# Altium project Modulator.PrjPCB (part 3 of 4)

## Sheet Multiplier_channel.SchDoc: Modulator v1.0
size 420 x 297 mm; Author: shanasz; CompanyName: WUT; DrawnBy: shanasz; Organization: WUT ISE; Address1: Warsaw Univeristy of Technology; Address2: Nowowiejska 15/19; DocumentNumber: 4; Revision: -; SheetNumber: 4; SheetTotal: 6; EDA_Number: ARTIQ; Projet: ARTIQ/SINARA; ModifiedBy: -; CreateDate: XX/XX/XXXX; CheckedDate: -; Title2: Modulator channel; DivGrp: ISE; Designer: shanasz; ModifiedDate: -; ProjectName: ARTIQ/SINARA
Used 2 times, as channels M1, M2. Parts and nets are listed once, with the designators drawn on the sheet.
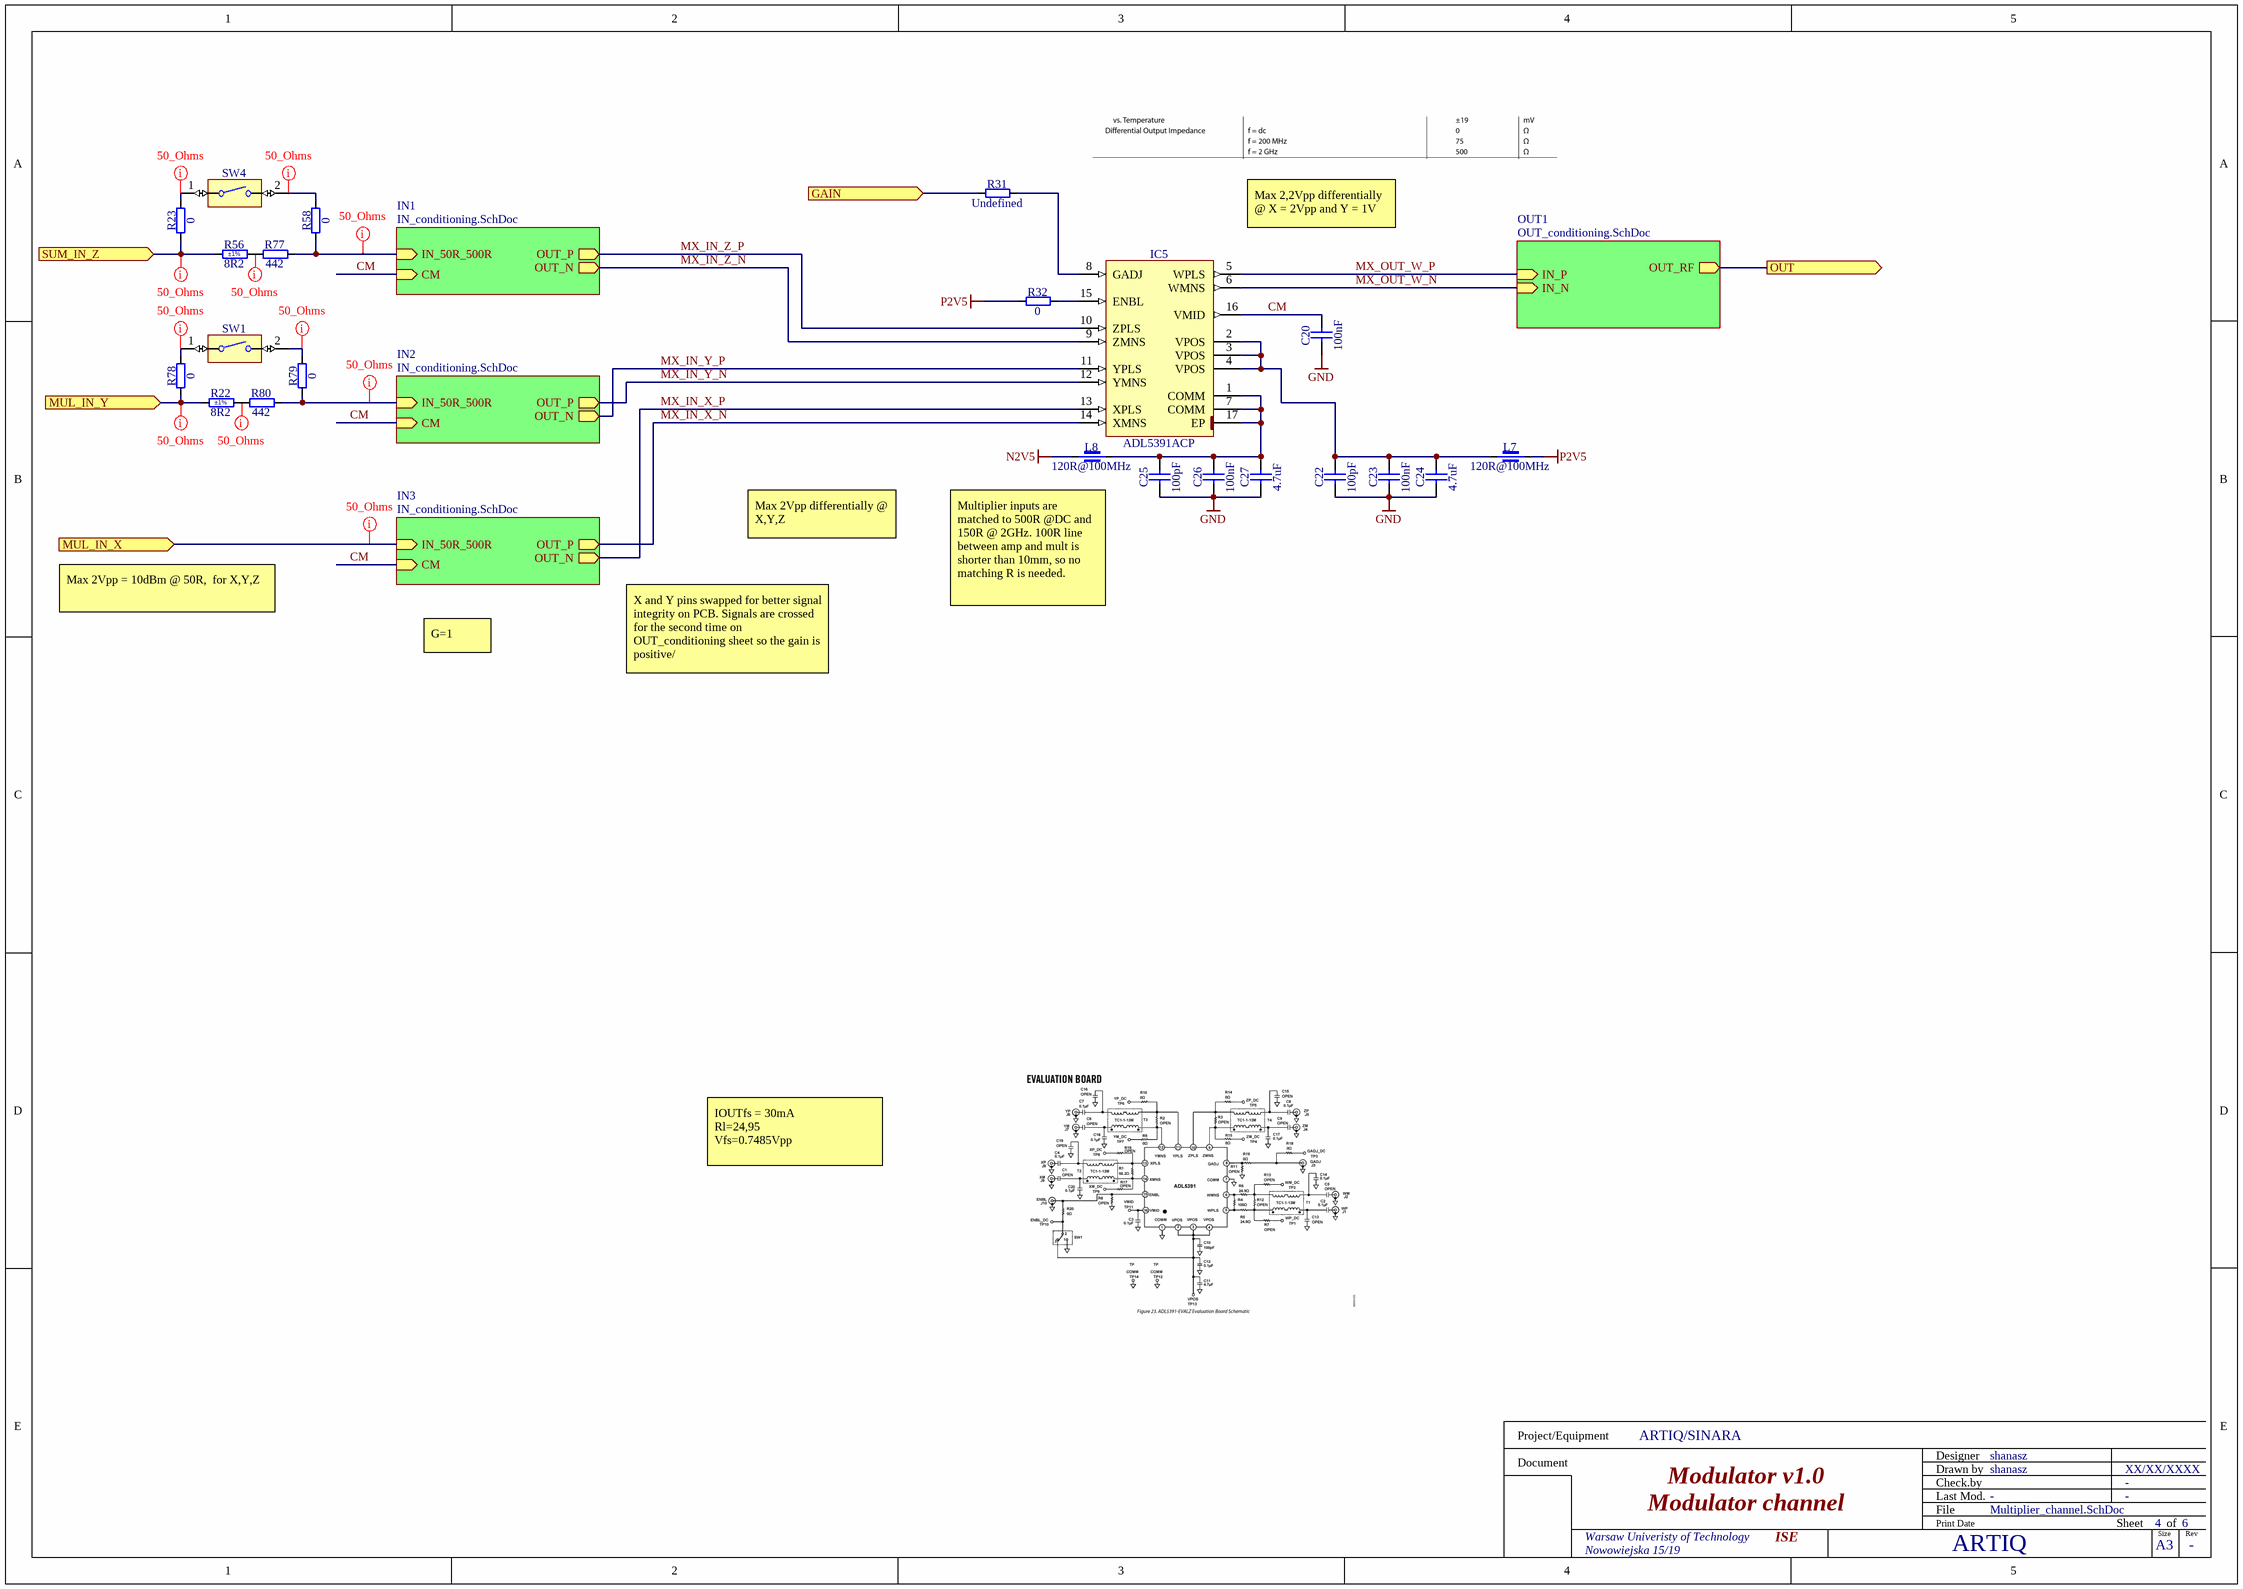
[diagram p3: Multiplier_channel.SchDoc]

### Parts
C20  100nF  [CAPC1005X55N]
C22  100pF  [CAPC1005X55N]
C23  100nF  [CAPC1005X55N]
C24  4.7uF  [CAPC1005X55N]
C25  100pF  [CAPC1005X55N]
C26  100nF  [CAPC1005X55N]
C27  4.7uF  [CAPC1005X55N]
IC5  ADL5391ACP  [QFN50P300X300X100-17N-S145]
L7  120R@100MHz  [INDC1005X55N]
L8  120R@100MHz  [INDC1005X55N]
R22  8R2  Tolerance: ±1%  [RESC1005X40N]
R23  0  [RESC1005X40N]
R31  Undefined  [RESC1005X40N]
R32  0  [RESC1005X40N]
R56  8R2  Tolerance: ±1%  [RESC1005X40N]
R58  0  [RESC1005X40N]
R77  442  [RESC1005X40N]
R78  0  [RESC1005X40N]
R79  0  [RESC1005X40N]
R80  442  [RESC1005X40N]
SW1  Switch  [SW_OMRON_A6SN-1101]  (value not drawn)
SW4  Switch  [SW_OMRON_A6SN-1101]  (value not drawn)

### Sub-sheets
IN1 = IN_conditioning.SchDoc: IN_50R_500R (in), OUT_P (out), OUT_N (out), CM (in)
IN2 = IN_conditioning.SchDoc: IN_50R_500R (in), OUT_P (out), OUT_N (out), CM (in)
IN3 = IN_conditioning.SchDoc: IN_50R_500R (in), OUT_P (out), OUT_N (out), CM (in)
OUT1 = OUT_conditioning.SchDoc: OUT_RF (out), IN_P (in), IN_N (in)

### Ports
GAIN (in), MUL_IN_X (in), MUL_IN_Y (in), OUT (out), SUM_IN_Z (in)

### Nets
GND: C20.1 C22.1 C23.1 C24.1 C25.1 C26.1 C27.1
N2V5: L8.1
P2V5: L7.2 R32.1
CM: C20.2 IC5.16(VMID) ; sheet IN1/CM, sheet IN2/CM, sheet IN3/CM
GAIN: R31.1 ; port GAIN
MUL_IN_X: port MUL_IN_X, sheet IN3/IN_50R_500R
MUL_IN_Y: R22.1 R78.1 ; port MUL_IN_Y
MX_IN_X_N: IC5.14(XMNS) ; sheet IN3/OUT_P
MX_IN_X_P: IC5.13(XPLS) ; sheet IN3/OUT_N
MX_IN_Y_N: IC5.12(YMNS) ; sheet IN2/OUT_P
MX_IN_Y_P: IC5.11(YPLS) ; sheet IN2/OUT_N
MX_IN_Z_N: IC5.9(ZMNS) ; sheet IN1/OUT_N
MX_IN_Z_P: IC5.10(ZPLS) ; sheet IN1/OUT_P
MX_OUT_W_N: IC5.6(WMNS) ; sheet OUT1/IN_N
MX_OUT_W_P: IC5.5(WPLS) ; sheet OUT1/IN_P
OUT: port OUT, sheet OUT1/OUT_RF
SUM_IN_Z: R23.1 R56.1 ; port SUM_IN_Z
NetC22_2: C22.2 C23.2 C24.2 IC5.2(VPOS) IC5.3(VPOS) IC5.4(VPOS) L7.1
NetC25_2: C25.2 C26.2 C27.2 IC5.1(COMM) IC5.7(COMM) IC5.17(EP) L8.2
NetIC5_8: IC5.8(GADJ) R31.2
NetIC5_15: IC5.15(ENBL) R32.2
NetR22_2: R22.2 R80.1
NetR23_2: R23.2 SW4.1
NetR56_2: R56.2 R77.1
NetR58_1: R58.1 R77.2 ; sheet IN1/IN_50R_500R
NetR58_2: R58.2 SW4.2
NetR78_2: R78.2 SW1.1
NetR79_1: R79.1 R80.2 ; sheet IN2/IN_50R_500R
NetR79_2: R79.2 SW1.2

### Channels
M1: designators C20=C20A C22=C22A C23=C23A C24=C24A C25=C25A C26=C26A C27=C27A IC5=IC5A L7=L7A L8=L8A R22=R22A R23=R23A R31=R31A R32=R32A R56=R56A#1 R58=R58A#1 R77=R77A R78=R78A R79=R79A R80=R80A SW1=SW1A SW4=SW4A; ports GAIN=NetJ4_1 MUL_IN_X=NetC11C_1 MUL_IN_Y=NetJ3_1 OUT=NetJ5_1 SUM_IN_Z=NetJ2_1
M2: designators C20=C20B C22=C22B C23=C23B C24=C24B C25=C25B C26=C26B C27=C27B IC5=IC5B L7=L7B L8=L8B R22=R22B R23=R23B R31=R31B R32=R32B R56=R56B#1 R58=R58B#1 R77=R77B R78=R78B R79=R79B R80=R80B SW1=SW1B SW4=SW4B; ports GAIN=NetJ6_1 MUL_IN_X=NetC11F_1 MUL_IN_Y=NetJ10_1 OUT=NetJ11_1 SUM_IN_Z=NetJ8_1

### Layout directives
net class 50_Ohms: NetC11A_1, NetC11B_1, NetC11C_1, NetJ2_1, NetJ3_1, NetR22A_2, NetR23A_2, NetR56A#1_2, NetR58A#1_2, NetR78A_2, NetR79A_2

### Notes on the sheet
- Max 2,2Vpp differentially @ X = 2Vpp and Y = 1V
- Max 2Vpp differentially @ X,Y,Z
- Max 2Vpp = 10dBm @ 50R,  for X,Y,Z
- G=1
- X and Y pins swapped for better signal integrity on PCB. Signals are crossed for the second time on OUT_conditioning sheet so the gain is positive/
- Multiplier inputs are matched to 500R @DC and 150R @ 2GHz. 100R line between amp and mult is shorter than 10mm, so no matching R is needed.
- IOUTfs = 30mA
  Rl=24,95
  Vfs=0.7485Vpp
- Project/Equipment
- Document
- Designer
- Drawn by
- Check.by
- File
- Last Mod.
- Print Date
- Sheet
- Size
- A3
- of
- Rev

### Library data of the parts
C20 C23 C26 = CC0402_100NF_16V_10%_X5R: as C2 on sheet LVDS_IFC_VCO; Part Number: CC0402_100NF_16V_10%_X5R; Component Kind: Standard; Component Type: Standard; Pin Count: 2; Value: 100nF; Status: None; Manufacturer Part Number: CC0402_100NF_16V_10%_X5R; Case: 0402; Mounted: Yes; Socket: No; SMD: Yes; Sense: No; Manufacturer1 Example: MURATA; Manufacturer1 ComponentHeight: 0.55mm; HelpURL: \\cern.ch\dfs\Applications\Altium\Datasheets\CC0402_X5R_MURATA_GRM.pdf; Author: CERN DEM JLC; CreateDate: 10.12.2013; LatestRevisionDate: 10.12.2013
C22 C25 = CC0402_100PF_50V_2%_C0G: Non-polarised capacitor; Part Description: SMD Multilayer Chip Ceramic Capacitor; Manufacturer: GENERIC; Manufacturer Part Number: CC0402_100PF_50V_5%_C0G; Manufacturer1 Part Number: C0402C101G5GAC; Voltage: 50V; TC: C0G/NP0; Tolerance: ±2%; Part Number: CC0402_100PF_50V_2%_C0G; Component Kind: Standard; Component Type: Standard; Pin Count: 2; Value: 100pF; Status: Preferred; Case: 0402; Mounted: Yes; Socket: No; SMD: Yes; Sense: No; Manufacturer1 Example: KEMET; Manufacturer1 ComponentHeight: 0.55mm; HelpURL: \\cern.ch\dfs\Applications\Altium\Datasheets\CC0402_C0G_KEMET_(Commercial Grade).pdf; Author: CERN DEM BC; CreateDate: 15.06.2020; LatestRevisionDate: 15.06.2020
C24 C27 = CC0402_4.7UF_4V_20%_X5R: Non-polarised capacitor; Part Description: SMD Multilayer Chip Ceramic Capacitor; Manufacturer: GENERIC; Manufacturer1 Part Number: C0402C475M7PAC; Voltage: 4V; TC: X5R; Tolerance: ±20%; Part Number: CC0402_4.7UF_4V_20%_X5R; Component Kind: Standard; Component Type: Standard; Pin Count: 2; Value: 4.7uF; Status: Preferred; Manufacturer Part Number: CC0402_4.7UF_4V_20%_X5R; Case: 0402; Mounted: Yes; Socket: No; SMD: Yes; Sense: No; Manufacturer1 Example: KEMET; Manufacturer1 ComponentHeight: 0.55mm; HelpURL: \\cern.ch\dfs\Applications\Altium\Datasheets\CC0402_X5R_KEMET.pdf; Author: CERN DEM JLC; CreateDate: 08.06.2010; LatestRevisionDate: 08.06.2010
IC5 = ADL5391ACP: DC to 2.0 GHz Multiplier; Manufacturer: ANALOG DEVICES; PressFit: No; Bonding: No; Part Number: ADL5391ACP; Component Kind: Standard; Component Type: Standard; Device: ADL5391ACP; Footprint: QFN50P300X300X80-17N-S165; PackageDescription: QFN, 0.50mm Pitch, Square; 16 Pin, 3.00mm L X 3.00mm W X 0.80mm H body (w/Thermal Tab 1.65 X 1.65mm), IPC Medium Density; Part Description: DC to 2.0 GHz Multiplier; Manufacturer Part Number: ADL5391ACP; Pin Count: 17; Case: QFN16; Mounted: Yes; Socket: No; SMD: Yes; Sense: No; ComponentHeight: 0.8mm; Author: CERN DEM HF; HelpURL: \\cern.ch\dfs\Applications\Altium\Datasheets\ADL5391.pdf; CreateDate: 03.08.2022; LatestRevisionDate: 03.08.2022
L7 L8 = IND0402_MURATA_BLM15PX121SN1D: Part Description: SMD EMIFIL Chip Ferrite Bead; Manufacturer: MURATA; Power: 2A; Resistance: 0.055R; Tolerance: ±25%; Part Number: IND0402_MURATA_BLM15PX121SN1D; Component Kind: Standard; Component Type: Standard; Pin Count: 2; Value: 120R@100MHz; Manufacturer Part Number: BLM15PX121SN1D; Case: 0402; Mounted: Yes; Socket: No; SMD: Yes; Sense: No; ComponentHeight: 0.55mm; HelpURL: \\cern.ch\dfs\Applications\Altium\Datasheets\IND0402_MURATA_BLM15PX.pdf; Author: CERN DEM JMW; CreateDate: 19.02.2014; LatestRevisionDate: 25.10.2018
R22 R56 = R0402_8R2_1%_0.0625W_200PPM: Resistor - 1%; Part Description: General Purpose Thick Film Chip Resistor; Manufacturer: GENERIC; Manufacturer1 Part Number: 232270678208L; TC: ±200ppm/°C; PressFit: No; Part Number: R0402_8R2_1%_0.0625W_200PPM; Component Kind: Standard; Component Type: Standard; Pin Count: 2; Value: 8R2; Status: Not Recommended; Power: 0.0625W; Manufacturer Part Number: R0402_8R2_1%_0.0625W_200PPM; Case: 0402; Mounted: Yes; Sense: No; Socket: No; SMD: Yes; Manufacturer1 Example: YAGEO PHYCOMP; Manufacturer1 ComponentHeight: 0.4mm; HelpURL: \\cern.ch\dfs\Applications\Altium\Datasheets\R0402_Phycomp_RC0402.pdf; Author: CERN DEM JLC; CreateDate: 03.12.2007; LatestRevisionDate: 17.10.2012
R23 R32 R58 R78 R79 = R0402_0R_JUMPER: as R61 on sheet LVDS_IFC_VCO; Part Number: R0402_0R_JUMPER; Component Kind: Standard; Component Type: Standard; Pin Count: 2; Value: 0; Status: Not Recommended; Manufacturer Part Number: R0402_0R_JUMPER; Case: 0402; Mounted: Yes; Sense: No; Socket: No; SMD: Yes; Manufacturer1 Example: YAGEO PHYCOMP; Manufacturer1 ComponentHeight: 0.4mm; HelpURL: \\cern.ch\dfs\Applications\Altium\Datasheets\R0402_Phycomp_RC0402.pdf; Author: CERN DEM JLC; CreateDate: 03.12.2007; LatestRevisionDate: 17.10.2012
R31 = R0402_NO-VALUE: Resistor; Part Description: Reserved Footprint For a 0402 (1005) Chip Resistor; PressFit: No; Mounted: No; Part Number: R0402_NO-VALUE; Component Kind: Standard; Component Type: Standard; Pin Count: 2; Value: Undefined; Status: None; Manufacturer: Undefined; Manufacturer Part Number: R0402_NO-VALUE; Case: 0402; Sense: No; Socket: No; SMD: Yes; Manufacturer1 Example: Undefined; Manufacturer1 Part Number: Undefined; Manufacturer1 ComponentHeight: Undefined; HelpURL: Undefined; Author: CERN DEM JLC; CreateDate: 03.12.2007; LatestRevisionDate: 13.03.2008
R77 R80 = R0402_442R_0.1%_0.063W_25PPM: Resistor - 0.1%; Part Description: Thin Film Chip Resistor; Manufacturer: GENERIC; Manufacturer1 Part Number: TNPW0402442RBEED; TC: ±25ppm; PressFit: No; Part Number: R0402_442R_0.1%_0.063W_25PPM; Component Kind: Standard; Component Type: Standard; Pin Count: 2; Value: 442; Status: Not Recommended; Manufacturer Part Number: R0402_442R_0.1%_0.063W_25PPM; Case: 0402; Mounted: Yes; Sense: No; Socket: No; SMD: Yes; Manufacturer1 Example: Vishay / Dale; Author: SHA
SW1 SW4 = SW_OMRON_A6SN-1101: 1 Ways SPST DIP Switch; Part Description: 1 Way SPST Surface-Mounting Slide Switch With Flat Actuator, Contact Rating 25mA 24VDC; Manufacturer: OMRON; PressFit: No; Part Number: SW_OMRON_A6SN-1101; Component Kind: Standard; Component Type: Standard; Pin Count: 2; PackageDescription: Body 4.48x7.5mm, 1 Way SPST Surface-Mounting Slide Switch With Flat Actuator (A6SN Series); Family: Switch; Mounted: Yes; Socket: No; SMD: Yes; Sense: No; Status: None; Manufacturer Part Number: A6SN-1101; ComponentHeight: 4.6mm; HelpURL: \\cern.ch\dfs\Applications\Altium\Datasheets\SW_OMRON_A6SN-1101.pdf; Author: CERN DEM JLC; CreateDate: 25.02.2013; LatestRevisionDate: 25.02.2013

## Sheet IN_conditioning.SchDoc: Modulator v1.0
size 420 x 297 mm; Author: shanasz; CompanyName: WUT; DrawnBy: shanasz; Organization: WUT ISE; Address1: Warsaw Univeristy of Technology; Address2: Nowowiejska 15/19; DocumentNumber: 5; Revision: -; SheetNumber: 5; SheetTotal: 6; EDA_Number: ARTIQ; Projet: ARTIQ/SINARA; ModifiedBy: -; CreateDate: XX/XX/XXXX; CheckedDate: -; Title2: Input signal conditioning; DivGrp: ISE; Designer: shanasz; ModifiedDate: -; ProjectName: ARTIQ/SINARA
Used 6 times, as channels M1/IN1, M1/IN2, M1/IN3, M2/IN1, M2/IN2, M2/IN3. Parts and nets are listed once, with the designators drawn on the sheet.
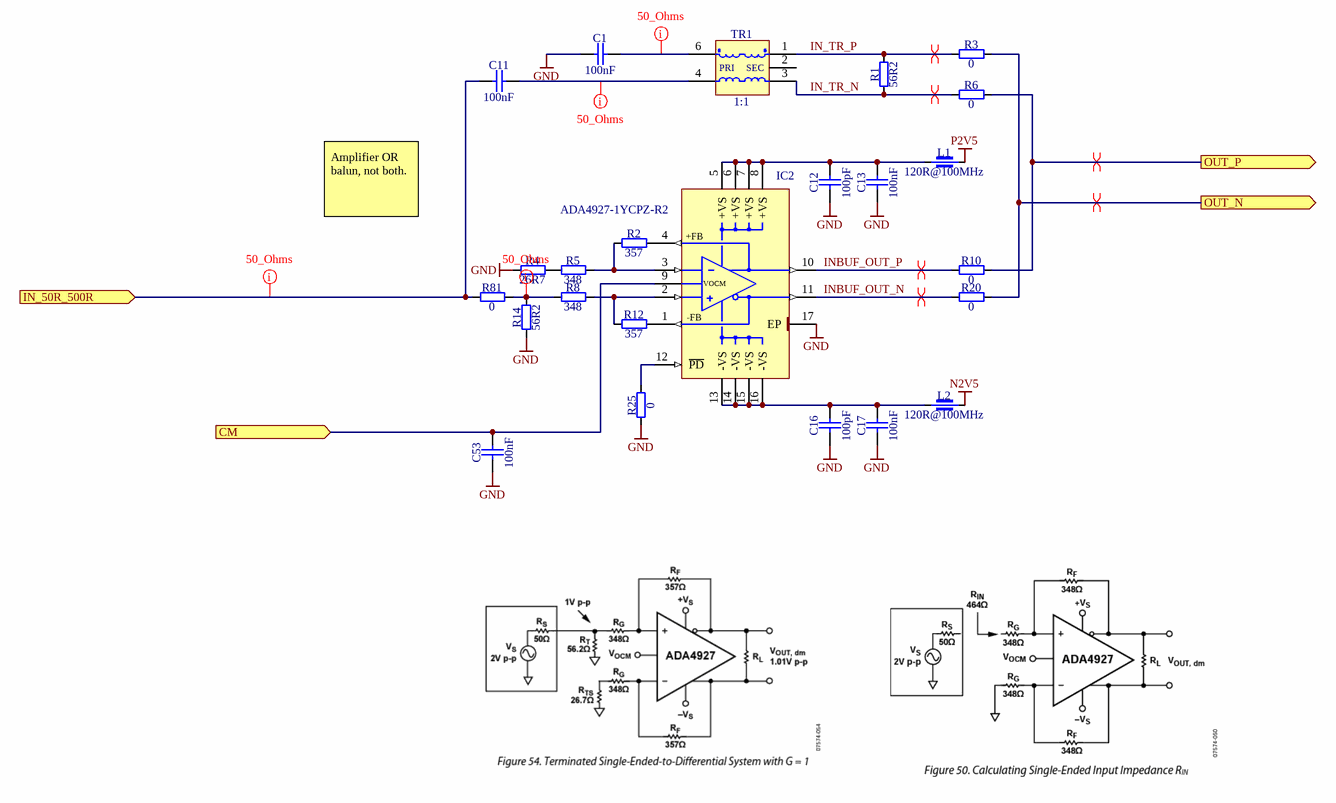
[diagram p4: IN_conditioning.SchDoc]

### Parts
C1  100nF  [CAPC1005X55N]
C11  100nF  [CAPC1005X55N]
C12  100pF  [CAPC1005X55N]
C13  100nF  [CAPC1005X55N]
C16  100pF  [CAPC1005X55N]
C17  100nF  [CAPC1005X55N]
C53  100nF  [CAPC1005X55N]
IC2  ADA4927-1YCPZ-R2  [QFN50P300X300X100-17N-S145]
L1  120R@100MHz  [INDC1005X55N]
L2  120R@100MHz  [INDC1005X55N]
R1  56R2  [RESC1005X40N]
R2  357  [RESC1005X40N]
R3  0  [RESC1005X40N]
R4  26R7  [RESC1005X40N]
R5  348  [RESC1005X40N]
R6  0  [RESC1005X40N]
R8  348  [RESC1005X40N]
R10  0  [RESC1005X40N]
R12  357  [RESC1005X40N]
R14  56R2  [RESC1005X40N]
R20  0  [RESC1005X40N]
R25  0  [RESC1005X40N]
R81  0  [RESC1005X40N]
TR1  1:1  [XFMR_MINI-CIRCUITS_AT224]

### Ports
CM (in), IN_50R_500R (in), OUT_N (out), OUT_P (out)

### Nets
GND: C1.1 C12.1 C13.1 C16.1 C17.1 C53.1 IC2.17(EP) R4.1 R14.1 R25.1
N2V5: L2.2
P2V5: L1.2
CM: C53.2 IC2.9(VOCM) ; port CM
IN_50R_500R: C11.1 R81.1 ; port IN_50R_500R
IN_TR_N: R1.1 R6.1 TR1.3(S)
IN_TR_P: R1.2 R3.1 TR1.1(SDOT)
INBUF_OUT_N: IC2.11(-OUT) R20.1
INBUF_OUT_P: IC2.10(+OUT) R10.1
OUT_N: R3.2 R20.2 ; port OUT_N
OUT_P: R6.2 R10.2 ; port OUT_P
NetC1_2: C1.2 TR1.6(PDOT)
NetC11_2: C11.2 TR1.4(P)
NetC12_2: C12.2 C13.2 IC2.5(+VS) IC2.6(+VS) IC2.7(+VS) IC2.8(+VS) L1.1
NetC16_2: C16.2 C17.2 IC2.13(-VS) IC2.14(-VS) IC2.15(-VS) IC2.16(-VS) L2.1
NetIC2_1: IC2.1(-FB) R12.2
NetIC2_2: IC2.2(+IN) R8.2 R12.1
NetIC2_3: IC2.3(-IN) R2.1 R5.2
NetIC2_4: IC2.4(+FB) R2.2
NetIC2_12: IC2.12(~{PD}) R25.2
NetR4_2: R4.2 R5.1
NetR8_1: R8.1 R14.2 R81.2

Not connected (* = marked no-connect by the designer): TR1 2(NC)

### Channels
M1/IN1: designators end in A; ports CM=CM_M1 IN_50R_500R=NetC11A_1 OUT_N=MX_IN_Z_N_M1 OUT_P=MX_IN_Z_P_M1
M1/IN2: designators end in B; ports CM=CM_M1 IN_50R_500R=NetC11B_1 OUT_N=MX_IN_Y_P_M1 OUT_P=MX_IN_Y_N_M1
M1/IN3: designators end in C; ports CM=CM_M1 IN_50R_500R=NetC11C_1 OUT_N=MX_IN_X_P_M1 OUT_P=MX_IN_X_N_M1
M2/IN1: designators end in D; ports CM=CM_M2 IN_50R_500R=NetC11D_1 OUT_N=MX_IN_Z_N_M2 OUT_P=MX_IN_Z_P_M2
M2/IN2: designators end in E; ports CM=CM_M2 IN_50R_500R=NetC11E_1 OUT_N=MX_IN_Y_P_M2 OUT_P=MX_IN_Y_N_M2
M2/IN3: designators end in F; ports CM=CM_M2 IN_50R_500R=NetC11F_1 OUT_N=MX_IN_X_P_M2 OUT_P=MX_IN_X_N_M2

### Layout directives
net class 50_Ohms: NetC1A_2, NetC11A_1, NetC11A_2, NetR8A_1
differential pair: IN_TR_N_IN1, IN_TR_P_IN1, INBUF_OUT_N_IN1, INBUF_OUT_P_IN1, MX_IN_Z_N_M1, MX_IN_Z_P_M1

### Notes on the sheet
- Amplifier OR balun, not both.
- Project/Equipment
- Document
- Designer
- Drawn by
- Check.by
- File
- Last Mod.
- Print Date
- Sheet
- Size
- A3
- of
- Rev
- (in symbol XFMR_MINI-CIRCUITS_TC1-1-13M+) PRI; SEC

### Library data of the parts
C1 C11 C13 C17 C53 = CC0402_100NF_16V_10%_X5R: as C2 on sheet LVDS_IFC_VCO; Part Number: CC0402_100NF_16V_10%_X5R; Component Kind: Standard; Component Type: Standard; Pin Count: 2; Value: 100nF; Status: None; Manufacturer Part Number: CC0402_100NF_16V_10%_X5R; Case: 0402; Mounted: Yes; Socket: No; SMD: Yes; Sense: No; Manufacturer1 Example: MURATA; Manufacturer1 ComponentHeight: 0.55mm; HelpURL: \\cern.ch\dfs\Applications\Altium\Datasheets\CC0402_X5R_MURATA_GRM.pdf; Author: CERN DEM JLC; CreateDate: 10.12.2013; LatestRevisionDate: 10.12.2013
C12 C16 = CC0402_100PF_50V_2%_C0G: as C22 on sheet Multiplier_channel; Part Number: CC0402_100PF_50V_2%_C0G; Component Kind: Standard; Component Type: Standard; Pin Count: 2; Value: 100pF; Status: Preferred; Case: 0402; Mounted: Yes; Socket: No; SMD: Yes; Sense: No; Manufacturer1 Example: KEMET; Manufacturer1 ComponentHeight: 0.55mm; HelpURL: \\cern.ch\dfs\Applications\Altium\Datasheets\CC0402_C0G_KEMET_(Commercial Grade).pdf; Author: CERN DEM BC; CreateDate: 15.06.2020; LatestRevisionDate: 15.06.2020
IC2 = ADA4927-1YCPZ-R2: Ultralow Distortion Current Feedback Differential ADC Driver; Manufacturer: ANALOG DEVICES; PressFit: No; Bonding: No; Part Number: ADA4927-1YCPZ-R2; Component Kind: Standard; Component Type: Standard; Device: ADA4927-1YCPZ-R2; PackageDescription: QFN, 0.50mm pitch, Square; 16 Pin, 3.00mm L X 3.00mm W X 1.00mm H body (w/Thermal Tab 1.45 X 1.45mm), IPC Medium Density; Part Description: Ultralow Distortion Current Feedback Differential ADC Driver; Manufacturer Part Number: ADA4927-1YCP; Pin Count: 17; Case: QFN16; Mounted: Yes; Socket: No; SMD: Yes; Sense: No; ComponentHeight: 1mm; Author: CERN DEM JLC; HelpURL: \\cern.ch\dfs\Applications\Altium\Datasheets\ADA4927-1YCPZ-R2.pdf; CreateDate: 19.04.2010; LatestRevisionDate: 31.03.2022
L1 L2 = IND0402_MURATA_BLM15PX121SN1D: as L7 on sheet Multiplier_channel; Part Number: IND0402_MURATA_BLM15PX121SN1D; Component Kind: Standard; Component Type: Standard; Pin Count: 2; Value: 120R@100MHz; Manufacturer Part Number: BLM15PX121SN1D; Case: 0402; Mounted: Yes; Socket: No; SMD: Yes; Sense: No; ComponentHeight: 0.55mm; HelpURL: \\cern.ch\dfs\Applications\Altium\Datasheets\IND0402_MURATA_BLM15PX.pdf; Author: CERN DEM JMW; CreateDate: 19.02.2014; LatestRevisionDate: 25.10.2018
R1 R14 = R0402_56R2_1%_0.063W_50PPM: Resistor - 1%; Part Description: Thin Film Chip Resistor; Manufacturer: GENERIC; Manufacturer1 Part Number: CRT0402-FZ-56R2GLF; TC: ±50ppm; PressFit: No; Part Number: R0402_56R2_1%_0.063W_50PPM; Component Kind: Standard; Component Type: Standard; Pin Count: 2; Value: 56R2; Status: Not Recommended; Manufacturer Part Number: R0402_56R2_1%_0.063W_50PPM; Case: 0402; Mounted: Yes; Sense: No; Socket: No; SMD: Yes; Manufacturer1 Example: Bourns; Author: SHA
R2 R12 = R0402_357R_0.1%_0.063W_50PPM: Resistor - 0.1%; Part Number: R0402_357R_0.1%_0.063W_25PPM; Part Description: Thin Film Chip Resistor; Manufacturer: GENERIC; Manufacturer1 Part Number: 1879214-5; TC: ±50ppm; PressFit: No; Component Kind: Standard; Component Type: Standard; Pin Count: 2; Value: 357; Status: Not Recommended; Manufacturer Part Number: R0402_357R_0.1%_0.063W_50PPM; Case: 0402; Mounted: Yes; Sense: No; Socket: No; SMD: Yes; Manufacturer1 Example: TE Connectivity / Amp; Author: SHA
R3 R6 R10 R20 R25 R81 = R0402_0R_JUMPER: as R61 on sheet LVDS_IFC_VCO; Part Number: R0402_0R_JUMPER; Component Kind: Standard; Component Type: Standard; Pin Count: 2; Value: 0; Status: Not Recommended; Manufacturer Part Number: R0402_0R_JUMPER; Case: 0402; Mounted: Yes; Sense: No; Socket: No; SMD: Yes; Manufacturer1 Example: YAGEO PHYCOMP; Manufacturer1 ComponentHeight: 0.4mm; HelpURL: \\cern.ch\dfs\Applications\Altium\Datasheets\R0402_Phycomp_RC0402.pdf; Author: CERN DEM JLC; CreateDate: 03.12.2007; LatestRevisionDate: 17.10.2012
R4 = R0402_26R7_1%_0.063W_100PPM: Resistor - 1%; Part Description: Thin Film Chip Resistor; Manufacturer: GENERIC; Manufacturer Part Number: R0402_26R7_0.1%_0.063W_25PPM; Manufacturer1 Part Number: CRCW040226R7FKED; TC: ±100ppm; PressFit: No; Part Number: R0402_26R7_1%_0.063W_100PPM; Component Kind: Standard; Component Type: Standard; Pin Count: 2; Value: 26R7; Status: Not Recommended; Case: 0402; Mounted: Yes; Sense: No; Socket: No; SMD: Yes; Manufacturer1 Example: Vishay / Dale; Author: SHA
R5 R8 = R0402_348R_0.1%_0.063W_25PPM: Resistor - 0.1%; Part Description: Thin Film Chip Resistor; Manufacturer: GENERIC; Manufacturer1 Part Number: RT0402BRD07348RL; TC: ±25ppm; PressFit: No; Part Number: R0402_348R_0.1%_0.063W_25PPM; Component Kind: Standard; Component Type: Standard; Pin Count: 2; Value: 348; Status: Not Recommended; Manufacturer Part Number: R0402_348R_0.1%_0.063W_25PPM; Case: 0402; Mounted: Yes; Sense: No; Socket: No; SMD: Yes; Manufacturer1 Example: YAGEO; Author: SHA
TR1 = XFMR_MINI-CIRCUITS_TC1-1-13M+: 50 Ohms 4.5 To 3000MHz RF Transformers; Part Number: XFMR_MINI-CIRCUITS_TC1-1-13M+; Component Kind: Standard; Component Type: Standard; Pin Count: 5; Value: 1:1; Status: None; Part Description: 50 Ohms 4.5 to 3000MHz RF Transformer; Manufacturer: MINI-CIRCUITS; Manufacturer Part Number: TC1-1-13M+; Mounted: Yes; Socket: No; Sense: No; SMD: Yes; ComponentHeight: 3.81mm; HelpURL: \\cern.ch\dfs\Applications\Altium\Datasheets\XFMR_MINI-CIRCUITS_TC1-1-13M+.pdf; Author: CERN DEM JLC; CreateDate: 30.11.2011; LatestRevisionDate: 30.11.2011

## Sheet OUT_conditioning.SchDoc: Modulator v1.0
size 420 x 297 mm; Author: shanasz; CompanyName: WUT; DrawnBy: shanasz; Organization: WUT ISE; Address1: Warsaw Univeristy of Technology; Address2: Nowowiejska 15/19; DocumentNumber: 6; Revision: -; SheetNumber: 6; SheetTotal: 6; EDA_Number: ARTIQ; Projet: ARTIQ/SINARA; ModifiedBy: -; CreateDate: XX/XX/XXXX; CheckedDate: -; Title2: Output signal conditioning; DivGrp: ISE; Designer: K.B.; ModifiedDate: -; ProjectName: ARTIQ/SINARA
Used 2 times, as channels M1/OUT1, M2/OUT1. Parts and nets are listed once, with the designators drawn on the sheet.
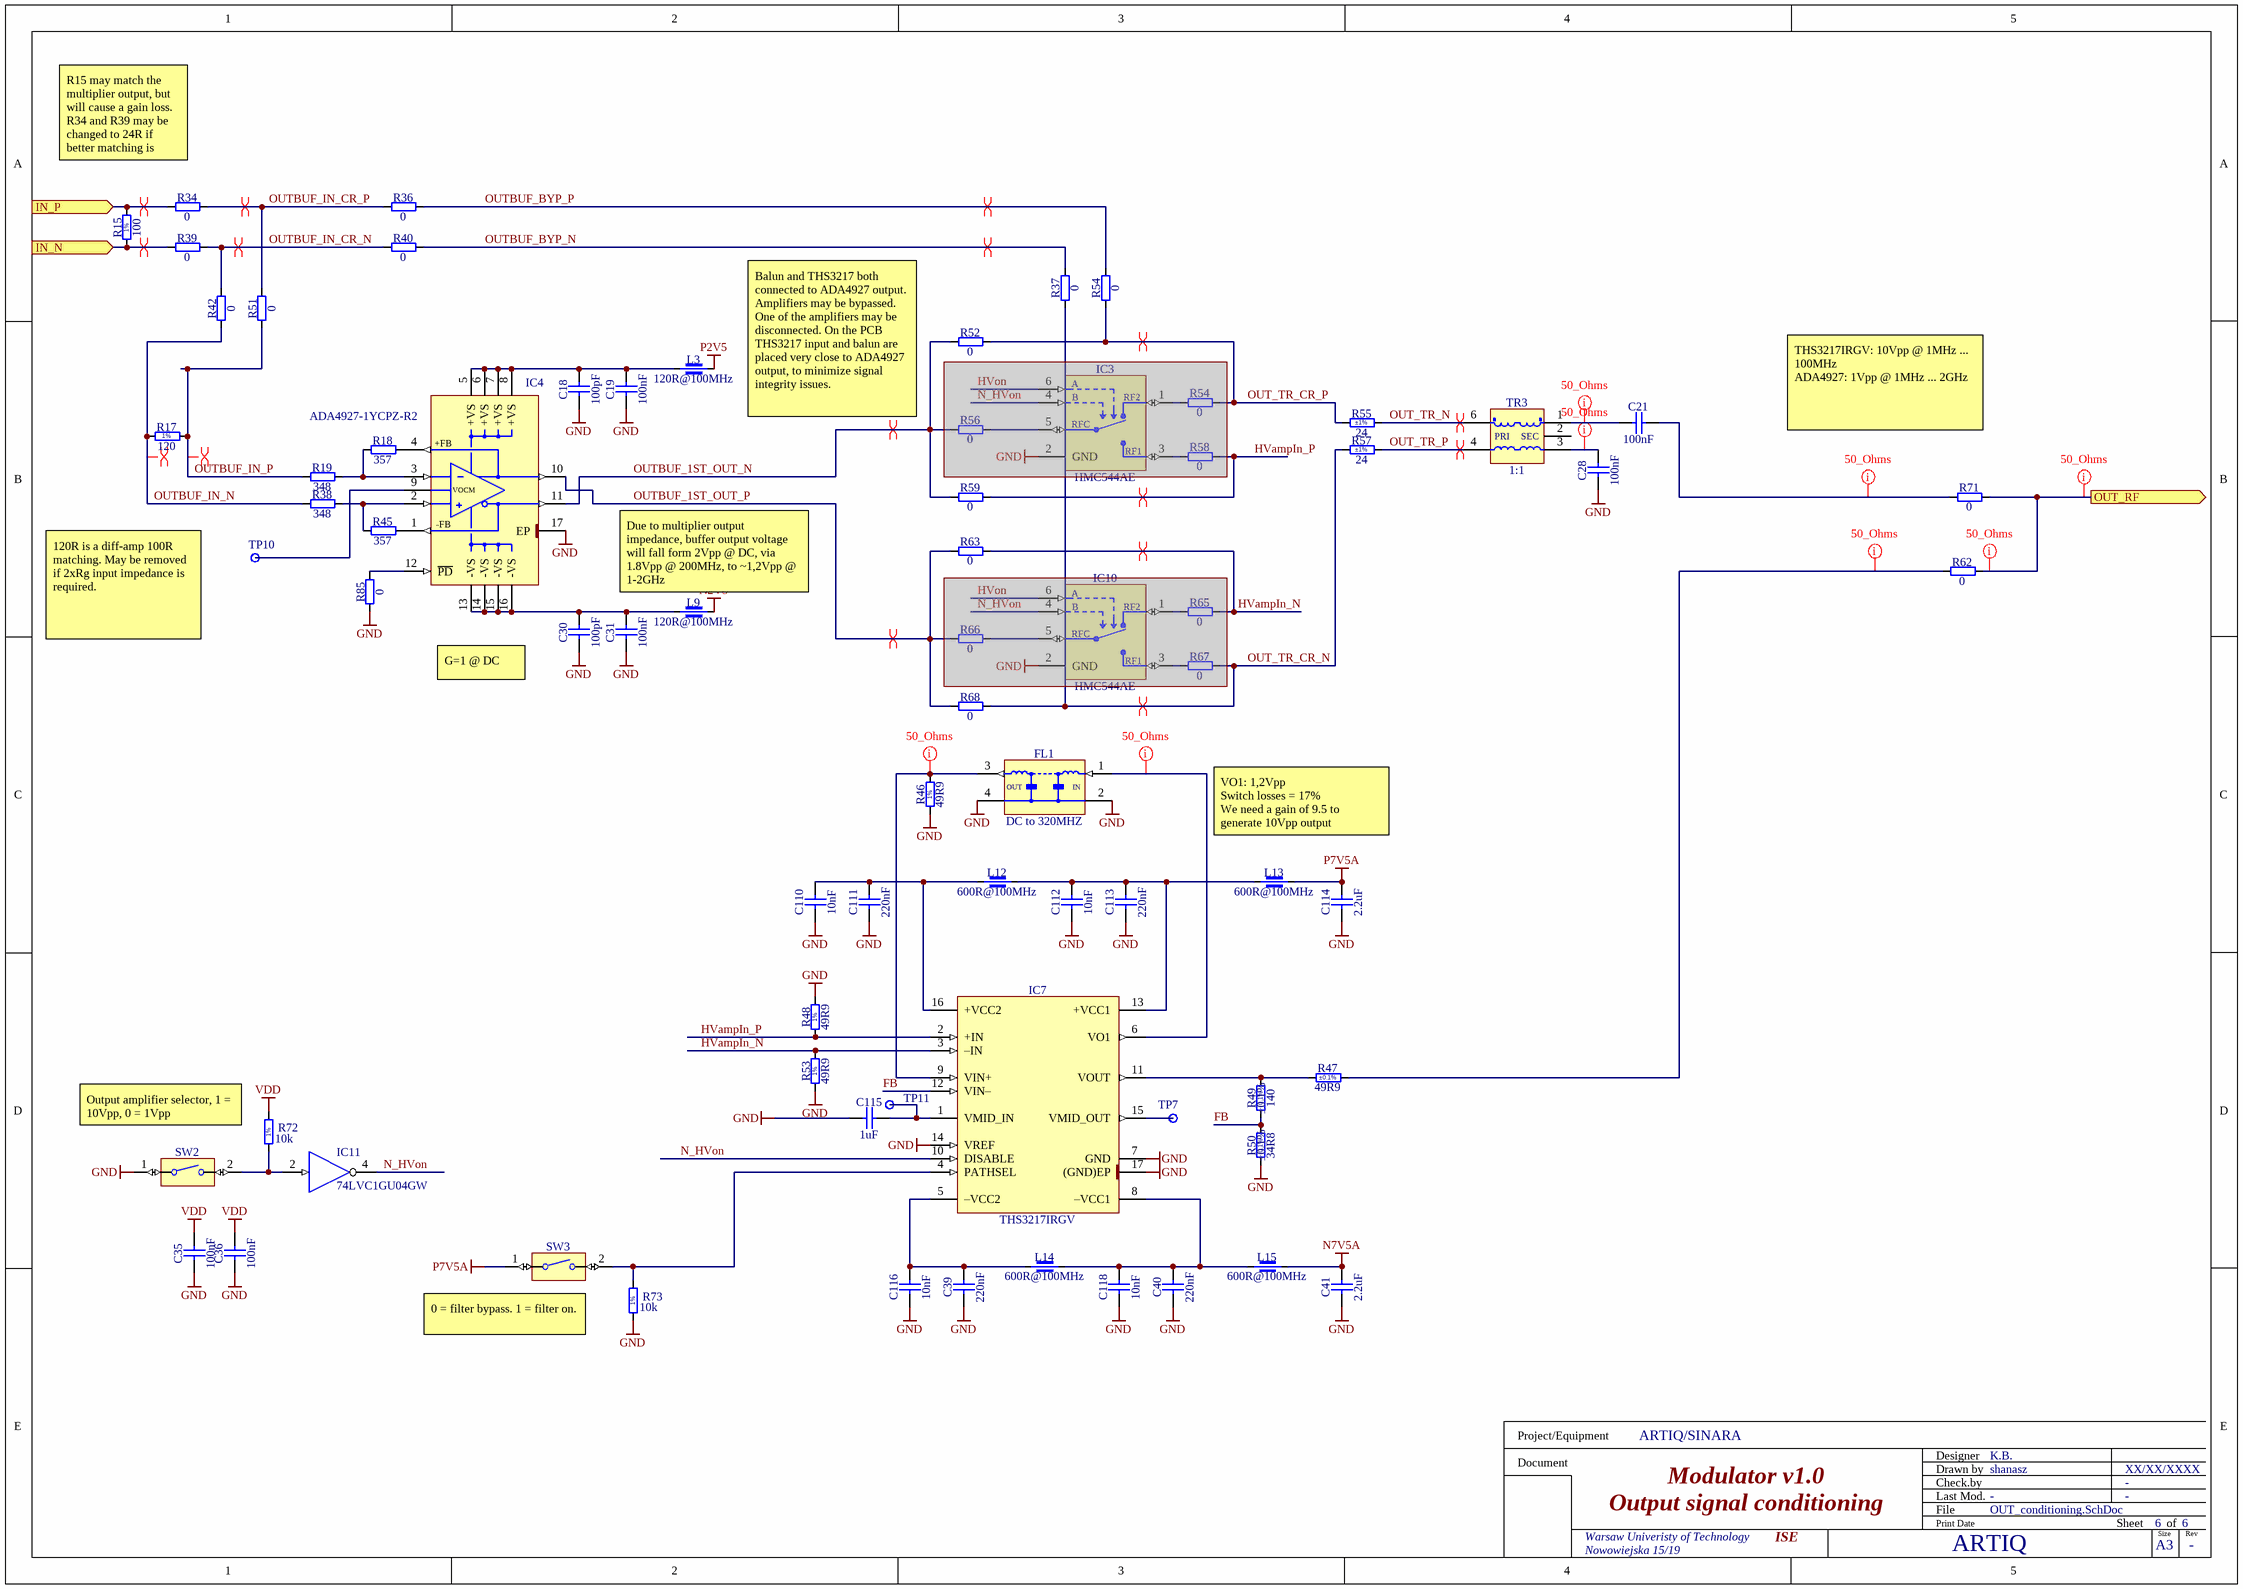
[diagram p5: OUT_conditioning.SchDoc]

### Parts
(Parts that share a designator on the sheet are numbered #1, #2 ... from top to bottom, then left to right.)
C18  100pF  [CAPC1005X55N]
C19  100nF  [CAPC1005X55N]
C21  100nF  [CAPC1005X55N]
C28  100nF  [CAPC1005X55N]
C30  100pF  [CAPC1005X55N]
C31  100nF  [CAPC1005X55N]
C35  100nF  [CAPC1005X55N]
C36  100nF  [CAPC1005X55N]
C39  220nF  [CAPC1005X55N]
C40  220nF  [CAPC1005X55N]
C41  2.2uF  [CAPC1608X87N]
C110  10nF  [CAPC1005X55N]
C111  220nF  [CAPC1005X55N]
C112  10nF  [CAPC1005X55N]
C113  220nF  [CAPC1005X55N]
C114  2.2uF  [CAPC1608X87N]
C115  1uF  [CAPC1005X55N]
C116  10nF  [CAPC1005X55N]
C118  10nF  [CAPC1005X55N]
FL1  DC to 320MHZ  [FIL_MINI-CIRCUITS_FV1206]
IC3  HMC544AE  [SOT95P280X145-6N]  (masked out: inside a compile mask, not in the netlist)
IC4  ADA4927-1YCPZ-R2  [QFN50P300X300X100-17N-S145]
IC7  THS3217IRGV  [QFN65P400X400X100-17N-S280]
IC10  HMC544AE  [SOT95P280X145-6N]  (masked out: inside a compile mask, not in the netlist)
IC11  74LVC1GU04GW  [SOT65P212X110-5N]
L3  120R@100MHz  [INDC1005X55N]
L9  120R@100MHz  [INDC1005X55N]
L12  600R@100MHz  [INDC1608X95N]
L13  600R@100MHz  [INDC1608X95N]
L14  600R@100MHz  [INDC1608X95N]
L15  600R@100MHz  [INDC1608X95N]
R15  100  [RESC1005X40N]
R17  120  [RESC1005X40N]
R18  357  [RESC1005X40N]
R19  348  [RESC1005X40N]
R34  0  [RESC1005X40N]
R36  0  [RESC1005X40N]
R37  0  [RESC1005X40N]
R38  348  [RESC1005X40N]
R39  0  [RESC1005X40N]
R40  0  [RESC1005X40N]
R42  0  [RESC1005X40N]
R45  357  [RESC1005X40N]
R46  49R9  [RESC1005X40N]
R47  49R9  Tolerance: ±0.1%  [RESC1608X55N]
R48  49R9  [RESC1005X40N]
R49  140  Tolerance: ±0.1%  [RESC1608X55N]
R50  34R8  Tolerance: ±0.1%  [RESC1608X55N]
R51  0  [RESC1005X40N]
R52  0  [RESC1005X40N]
R53  49R9  [RESC1005X40N]
R54#1  0  [RESC1005X40N]
R54#2  0  [RESC1005X40N]  (masked out: inside a compile mask, not in the netlist)
R55  24  Tolerance: ±1%  [RESC1005X40N]
R56  0  [RESC1005X40N]  (masked out: inside a compile mask, not in the netlist)
R57  24  Tolerance: ±1%  [RESC1005X40N]
R58  0  [RESC1005X40N]  (masked out: inside a compile mask, not in the netlist)
R59  0  [RESC1005X40N]
R62  0  [RESC1005X40N]
R63  0  [RESC1005X40N]
R65  0  [RESC1005X40N]  (masked out: inside a compile mask, not in the netlist)
R66  0  [RESC1005X40N]  (masked out: inside a compile mask, not in the netlist)
R67  0  [RESC1005X40N]  (masked out: inside a compile mask, not in the netlist)
R68  0  [RESC1005X40N]
R71  0  [RESC1005X40N]
R72  10k  [RESC1005X40N]
R73  10k  [RESC1005X40N]
R85  0  [RESC1005X40N]
SW2  Switch  [SW_OMRON_A6SN-1101]  (value not drawn)
SW3  Switch  [SW_OMRON_A6SN-1101]  (value not drawn)
TP7  Test Point  [TPS127]  (value not drawn)  (no BOM)
TP10  Test Point  [TPS127]  (value not drawn)  (no BOM)
TP11  Test Point  [TPS127]  (value not drawn)  (no BOM)
TR3  1:1  [XFMR_MINI-CIRCUITS_AT224]

### Ports
IN_N (in), IN_P (in), OUT_RF (out)

### Nets
GND: C18.1 C19.1 C28.1 C30.1 C31.1 C35.1 C36.1 C39.1 C40.1 C41.1 C110.1 C111.1 C112.1 C113.1 C114.1 C115.1 C116.1 C118.1 FL1.2(GND) FL1.4(GND) IC4.17(EP) IC7.7(GND) IC7.14(VREF) IC7.17((GND)EP) IC11.3(GND) R46.1 R48.2 R50.1 R53.1 R73.1 R85.1 SW2.1
N2V5: L9.2
N7V5A: C41.2 L15.2
P2V5: L3.2
P7V5A: C114.2 L13.2 SW3.1
VDD: C35.2 C36.2 IC11.5(VCC) R72.2
FB: IC7.12(VIN–) R49.1 R50.2
HVampIn_N: IC7.3(–IN) R53.2 R63.2
HVampIn_P: IC7.2(+IN) R48.1 R59.2
IN_N: R15.1 R39.1 ; port IN_N
IN_P: R15.2 R34.1 ; port IN_P
N_HVon: IC7.10(DISABLE) IC11.4(OUT)
OUT_RF: R62.2 R71.2 ; port OUT_RF
OUT_TR_CR_N: R37.1 R57.1 R68.2
OUT_TR_CR_P: R52.2 R54#1.1 R55.1
OUT_TR_N: R55.2 TR3.6(PDOT)
OUT_TR_P: R57.2 TR3.4(P)
OUTBUF_1ST_OUT_N: IC4.11(-OUT) R52.1 R59.1
OUTBUF_1ST_OUT_P: IC4.10(+OUT) R63.1 R68.1
OUTBUF_BYP_N: R37.2 R40.2
OUTBUF_BYP_P: R36.2 R54#1.2
OUTBUF_IN_CR_N: R39.2 R40.1 R42.2
OUTBUF_IN_CR_P: R34.2 R36.1 R51.2
OUTBUF_IN_N: R17.1 R38.1 R42.1
OUTBUF_IN_P: R17.2 R19.1 R51.1
NetC18_2: C18.2 C19.2 IC4.5(+VS) IC4.6(+VS) IC4.7(+VS) IC4.8(+VS) L3.1
NetC21_1: C21.1 TR3.1(SDOT)
NetC21_2: C21.2 R71.1
NetC28_2: C28.2 TR3.3(S)
NetC30_2: C30.2 C31.2 IC4.13(-VS) IC4.14(-VS) IC4.15(-VS) IC4.16(-VS) L9.1
NetC39_2: C39.2 C116.2 IC7.5(–VCC2) L14.1
NetC40_2: C40.2 C118.2 IC7.8(–VCC1) L14.2 L15.1
NetC110_2: C110.2 C111.2 IC7.16(+VCC2) L12.1
NetC112_2: C112.2 C113.2 IC7.13(+VCC1) L12.2 L13.1
NetC115_2: C115.2 IC7.1(VMID_IN) TP11.1
NetFL1_1: FL1.1(RFIN) IC7.6(VO1)
NetFL1_3: FL1.3(RFOUT) IC7.9(VIN+) R46.2
NetIC4_1: IC4.1(-FB) R45.2
NetIC4_2: IC4.2(+IN) R38.2 R45.1
NetIC4_3: IC4.3(-IN) R18.1 R19.2
NetIC4_4: IC4.4(+FB) R18.2
NetIC4_9: IC4.9(VOCM) TP10.1
NetIC4_12: IC4.12(~{PD}) R85.2
NetIC7_4: IC7.4(PATHSEL) R73.2 SW3.2
NetIC7_11: IC7.11(VOUT) R47.1 R49.2
NetIC7_15: IC7.15(VMID_OUT) TP7.1
NetIC11_2: IC11.2(IN) R72.1 SW2.2
NetR47_2: R47.2 R62.1

Not connected (* = marked no-connect by the designer): TR3 2(NC)

### Channels
M1/OUT1: designators C18=C18A C19=C19A C21=C21A C28=C28A C30=C30A C31=C31A C35=C35A C36=C36A C39=C39A C40=C40A C41=C41A C110=C110A C111=C111A C112=C112A C113=C113A C114=C114A C115=C115A C116=C116A C118=C118A FL1=FL1A IC3=IC3A IC4=IC4A IC7=IC7A IC10=IC10A IC11=IC11A L3=L3A L9=L9A L12=L12A L13=L13A L14=L14A L15=L15A R15=R15A R17=R17A R18=R18A R19=R19A R34=R34A R36=R36A R37=R37A R38=R38A R39=R39A R40=R40A R42=R42A R45=R45A R46=R46A R47=R47A R48=R48A R49=R49A R50=R50A R51=R51A R52=R52A R53=R53A R54=R54A#2 R54=R54A#1 R55=R55A R56=R56A#2 R57=R57A R58=R58A#2 R59=R59A R62=R62A R63=R63A R65=R65A R66=R66A R67=R67A R68=R68A R71=R71A R72=R72A R73=R73A R85=R85A SW2=SW2A SW3=SW3A TP7=TP7A TP10=TP10A TP11=TP11A TR3=TR3A; ports IN_N=MX_OUT_W_N_M1 IN_P=MX_OUT_W_P_M1 OUT_RF=NetJ5_1
M2/OUT1: designators C18=C18B C19=C19B C21=C21B C28=C28B C30=C30B C31=C31B C35=C35B C36=C36B C39=C39B C40=C40B C41=C41B C110=C110B C111=C111B C112=C112B C113=C113B C114=C114B C115=C115B C116=C116B C118=C118B FL1=FL1B IC3=IC3B IC4=IC4B IC7=IC7B IC10=IC10B IC11=IC11B L3=L3B L9=L9B L12=L12B L13=L13B L14=L14B L15=L15B R15=R15B R17=R17B R18=R18B R19=R19B R34=R34B R36=R36B R37=R37B R38=R38B R39=R39B R40=R40B R42=R42B R45=R45B R46=R46B R47=R47B R48=R48B R49=R49B R50=R50B R51=R51B R52=R52B R53=R53B R54=R54B#2 R54=R54B#1 R55=R55B R56=R56B#2 R57=R57B R58=R58B#2 R59=R59B R62=R62B R63=R63B R65=R65B R66=R66B R67=R67B R68=R68B R71=R71B R72=R72B R73=R73B R85=R85B SW2=SW2B SW3=SW3B TP7=TP7B TP10=TP10B TP11=TP11B TR3=TR3B; ports IN_N=MX_OUT_W_N_M2 IN_P=MX_OUT_W_P_M2 OUT_RF=NetJ11_1

### Layout directives
net class 50_Ohms: NetC21A_1, NetC21A_2, NetC28A_2, NetFL1A_1, NetFL1A_3, NetJ5_1, NetR47A_2
differential pair: HVampIn_N_OUT1, HVampIn_P_OUT1, MX_OUT_W_N_M1, MX_OUT_W_P_M1, OUT_TR_CR_N_OUT1, OUT_TR_CR_P_OUT1, OUT_TR_N_OUT1, OUT_TR_P_OUT1, OUTBUF_1ST_OUT_N_OUT1, OUTBUF_1ST_OUT_P_OUT1, OUTBUF_BYP_N_OUT1, OUTBUF_BYP_P_OUT1, OUTBUF_IN_CR_N_OUT1, OUTBUF_IN_CR_P_OUT1, OUTBUF_IN_N_OUT1, OUTBUF_IN_P_OUT1

### Notes on the sheet
- R15 may match the multiplier output, but will cause a gain loss. R34 and R39 may be changed to 24R if better matching is needed
- Balun and THS3217 both connected to ADA4927 output. Amplifiers may be bypassed. One of the amplifiers may be disconnected. On the PCB THS3217 input and balun are placed very close to ADA4927 output, to minimize signal integrity issues.
- THS3217IRGV: 10Vpp @ 1MHz ... 100MHz
  ADA4927: 1Vpp @ 1MHz ... 2GHz
- Due to multiplier output impedance, buffer output voltage will fall form 2Vpp @ DC, via 1.8Vpp @ 200MHz, to ~1,2Vpp @ 1-2GHz
- 120R is a diff-amp 100R matching. May be removed if 2xRg input impedance is required.
- G=1 @ DC
- VO1: 1,2Vpp
  Switch losses = 17%
  We need a gain of 9.5 to generate 10Vpp output
- (near R72) Output amplifier selector, 1 = 10Vpp, 0 = 1Vpp
- (near SW3) 0 = filter bypass. 1 = filter on.
- Project/Equipment
- Document
- Designer
- Drawn by
- Check.by
- File
- Last Mod.
- Print Date
- Sheet
- Size
- A3
- of
- Rev
- (in symbol FIL_MINI-CIRCUITS_LFCN-320+) OUT; IN
- (in symbol R0402_10K_1%_0.0625W_100PPM) 1%
- (in symbol R0402_49R9_1%_0.0625W_100PPM) 1%
- (in symbol R0402_100R_1%_0.0625W_100PPM) 1%
- (in symbol R0402_120R_1%_0.0625W_100PPM) 1%
- (in symbol R0603_34R8_0.1%_0.063W_10PPM) 0.1%
- (in symbol R0603_140R_0.1%_0.063W_10PPM) 0.1%
- (in symbol XFMR_MINI-CIRCUITS_TC1-1-13M+) PRI; SEC

### Library data of the parts
C18 C30 = CC0402_100PF_50V_2%_C0G: Non-polarised capacitor; Part Description: SMD Multilayer Chip Ceramic Capacitor; Manufacturer: GENERIC; Manufacturer Part Number: CC0402_100PF_50V_5%_C0G; Manufacturer1 Part Number: C0402C101G5GAC; Voltage: 50V; TC: C0G/NP0; Tolerance: ±2%; Part Number: CC0402_100PF_50V_2%_C0G; Component Kind: Standard; Component Type: Standard; Pin Count: 2; Value: 100pF; Status: Preferred; Case: 0402; Mounted: Yes; Socket: No; SMD: Yes; Sense: No; Manufacturer1 Example: KEMET; Manufacturer1 ComponentHeight: 0.55mm; HelpURL: \\cern.ch\dfs\Applications\Altium\Datasheets\CC0402_C0G_KEMET_(Commercial Grade).pdf; Author: CERN DEM BC; CreateDate: 15.06.2020; LatestRevisionDate: 15.06.2020
C19 C21 C28 C31 C35 C36 = CC0402_100NF_16V_10%_X5R: Non-polarised capacitor; Part Description: SMD Multilayer Chip Ceramic Capacitor; Manufacturer: GENERIC; Manufacturer1 Part Number: GRM155R61C104KA88D; Voltage: 16V; TC: X5R; Tolerance: ±10%; Part Number: CC0402_100NF_16V_10%_X5R; Component Kind: Standard; Component Type: Standard; Pin Count: 2; Value: 100nF; Status: None; Manufacturer Part Number: CC0402_100NF_16V_10%_X5R; Case: 0402; Mounted: Yes; Socket: No; SMD: Yes; Sense: No; Manufacturer1 Example: MURATA; Manufacturer1 ComponentHeight: 0.55mm; HelpURL: \\cern.ch\dfs\Applications\Altium\Datasheets\CC0402_X5R_MURATA_GRM.pdf; Author: CERN DEM JLC; CreateDate: 10.12.2013; LatestRevisionDate: 10.12.2013
C39 C40 C111 C113 = CC0402_220NF_16V_10%_X7R: Non-polarised capacitor; Part Description: SMD Multilayer Chip Ceramic Capacitor; Manufacturer: GENERIC; Manufacturer1 Part Number: C1005X7R1C224K050; Voltage: 16V; TC: X7R; Tolerance: ±10%; Part Number: CC0402_220NF_16V_10%_X7R; Component Kind: Standard; Component Type: Standard; Pin Count: 2; Value: 220nF; Status: Preferred; Manufacturer Part Number: CC0402_220NF_16V_10%_X7R; Case: 0402; Mounted: Yes; Socket: No; SMD: Yes; Sense: No; Manufacturer1 Example: TDK; Manufacturer1 ComponentHeight: 0.55mm; HelpURL: \\cern.ch\dfs\Applications\Altium\Datasheets\CC0402_X7R_TDK_C.pdf; Author: CERN DEM JLC; CreateDate: 25.10.2012; LatestRevisionDate: 25.10.2012
C41 C114 = CC0603_2.2UF_16V_10%_X5R: Non-polarised capacitor; Part Description: SMD Multilayer Chip Ceramic Capacitor; Manufacturer: GENERIC; Manufacturer1 Part Number: CC0603KRX5R7BB225; Voltage: 16V; TC: X5R; Tolerance: ±10%; Part Number: CC0603_2.2UF_16V_10%_X5R; Component Kind: Standard; Component Type: Standard; Pin Count: 2; Value: 2.2uF; Status: Preferred; Manufacturer Part Number: CC0603_2.2UF_16V_10%_X5R; Case: 0603; Mounted: Yes; Socket: No; SMD: Yes; Sense: No; Manufacturer1 Example: YAGEO PHYCOMP; Manufacturer1 ComponentHeight: 0.9mm; HelpURL: \\cern.ch\dfs\Applications\Altium\Datasheets\CC0805_X5R_PHYCOMP_HC.pdf; Author: CERN DEM JLC; CreateDate: 28.04.2011; LatestRevisionDate: 28.04.2011
C110 C112 C116 C118 = CC0402_10NF_16V_10%_X7R: Non-polarised capacitor; Part Description: SMD Multilayer Chip Ceramic Capacitor; Manufacturer: GENERIC; Manufacturer1 Part Number: 223878715636; Voltage: 16V; TC: X7R; Tolerance: ±10%; Part Number: CC0402_10NF_16V_10%_X7R; Component Kind: Standard; Component Type: Standard; Pin Count: 2; Value: 10nF; Status: Not Recommended; Manufacturer Part Number: CC0402_10NF_16V_10%_X7R; Case: 0402; Mounted: Yes; Socket: No; SMD: Yes; Sense: No; Manufacturer1 Example: PHYCOMP; Manufacturer1 ComponentHeight: 0.55mm; HelpURL: \\cern.ch\dfs\Applications\Altium\Datasheets\CC0402_X7R_PHYCOMP.pdf; Author: CERN DEM JLC; CreateDate: 03.12.2007; LatestRevisionDate: 03.12.2007
C115 = CC0402_1UF_16V_10%_X5R: Non-polarised capacitor; Part Description: SMD Multilayer Chip Ceramic Capacitor; Manufacturer: GENERIC; Manufacturer1 Part Number: C1005X5R1C105KT; Voltage: 16V; TC: X5R; Tolerance: ±10%; Part Number: CC0402_1UF_16V_10%_X5R; Component Kind: Standard; Component Type: Standard; Pin Count: 2; Value: 1uF; Status: Preferred; Manufacturer Part Number: CC0402_1UF_16V_10%_X5R; Case: 0402; Mounted: Yes; Socket: No; SMD: Yes; Sense: No; Manufacturer1 Example: TDK; Manufacturer1 ComponentHeight: 0.55mm; HelpURL: \\cern.ch\dfs\Applications\Altium\Datasheets\CC0402_X5R_TDK_C.pdf; Author: CERN DEM JLC; CreateDate: 25.10.2012; LatestRevisionDate: 25.10.2012
FL1 = FIL_MINI-CIRCUITS_LFCN-320+: 50 Ohm Low Pass Filter; Part Number: FIL_MINI-CIRCUITS_LFCN-320+; Component Kind: Standard; Component Type: Standard; Pin Count: 4; Value: DC to 320MHZ; Part Description: 50 Ohm Low Pass Filter; Manufacturer: MINI-CIRCUITS; Manufacturer Part Number: LFCN-320+; Mounted: Yes; Socket: No; SMD: Yes; Sense: No; ComponentHeight: 0.94mm; HelpURL: \\cern.ch\dfs\Applications\Altium\Datasheets\FIL_MINI-CIRCUITS_LFCN-320+.pdf; Author: CERN DEM MR; CreateDate: 29.09.2017; LatestRevisionDate: 29.09.2017
IC3 IC10 = HMC544AE: GaAs MMIC T/R Switch DC - 4 GHz; Manufacturer: ANALOG DEVICES; PressFit: No; Bonding: No; Part Number: HMC544AE; Component Kind: Standard; Component Type: Standard; Device: HMC544AE; PackageDescription: SOT, 0.95mm Pitch; 6 Pin, 1.60mm W X 2.90mm L X 1.45mm H body, IPC Medium Density; Part Description: GaAs MMIC T/R Switch DC - 4 GHz; Manufacturer Part Number: HMC544AE; Pin Count: 6; Case: SOT23-6; Mounted: Yes; Socket: No; SMD: Yes; Sense: No; ComponentHeight: 1.45mm; Author: CERN DEM MR; HelpURL: \\cern.ch\dfs\Applications\Altium\Datasheets\HMC544AE.pdf; CreateDate: 26.09.2017; LatestRevisionDate: 26.09.2017
IC4 = ADA4927-1YCPZ-R2: Ultralow Distortion Current Feedback Differential ADC Driver; Manufacturer: ANALOG DEVICES; PressFit: No; Bonding: No; Part Number: ADA4927-1YCPZ-R2; Component Kind: Standard; Component Type: Standard; Device: ADA4927-1YCPZ-R2; PackageDescription: QFN, 0.50mm pitch, Square; 16 Pin, 3.00mm L X 3.00mm W X 1.00mm H body (w/Thermal Tab 1.45 X 1.45mm), IPC Medium Density; Part Description: Ultralow Distortion Current Feedback Differential ADC Driver; Manufacturer Part Number: ADA4927-1YCP; Pin Count: 17; Case: QFN16; Mounted: Yes; Socket: No; SMD: Yes; Sense: No; ComponentHeight: 1mm; Author: CERN DEM JLC; HelpURL: \\cern.ch\dfs\Applications\Altium\Datasheets\ADA4927-1YCPZ-R2.pdf; CreateDate: 19.04.2010; LatestRevisionDate: 31.03.2022
IC7 = THS3217IRGV: DC to 800-MHz, Differential-to-Single-Ended, DAC Output Amplifier; Manufacturer: TEXAS INSTRUMENTS; PressFit: No; Bonding: No; Part Number: THS3217IRGV; Component Kind: Standard; Component Type: Standard; Device: THS3217IRGV; Footprint: QFN65P400X400X100-17N-S225; PackageDescription: QFN, 0.65mm Pitch; Square; 16 Pin, 4.00mm L X 4.00mm W X 1.00mm H body (w/Thermal Tab 2.25 X 2.25mm), IPC Medium Density; Part Description: DC to 800-MHz, Differential-to-Single-Ended, DAC Output Amplifier; Manufacturer Part Number: THS3217IRGV; Pin Count: 17; Case: QFN16; Mounted: Yes; Socket: No; SMD: Yes; Sense: No; ComponentHeight: 1mm; Author: CERN DEM HF; HelpURL: \\cern.ch\dfs\Applications\Altium\Datasheets\THS3217.pdf; CreateDate: 22.10.2021; LatestRevisionDate: 22.10.2021
IC11 = 74LVC1GU04GW: Single Inverter Buffer; Manufacturer: NXP SEMICONDUCTORS; PressFit: No; Bonding: No; Part Number: 74LVC1GU04GW; Component Kind: Standard; Component Type: Standard; Device: 74LVC1GU04GW; PackageDescription: SOT353, SOT, 0.65mm Pitch, 5 pin, 1.25mm W X 2.05mm L X 1.10mm H, IPC Medium Density; Part Description: Inverter; Manufacturer Part Number: 74LVC1GU04GW; Pin Count: 3; Case: SOT353; Mounted: Yes; Socket: No; SMD: Yes; Sense: No; ComponentHeight: 1.1mm; Author: CERN DEM JLC; HelpURL: \\cern.ch\dfs\Applications\Altium\Datasheets\74LVC1GU04GW.pdf; CreateDate: 11.01.2011; LatestRevisionDate: 11.01.2011
L3 L9 = IND0402_MURATA_BLM15PX121SN1D: Part Description: SMD EMIFIL Chip Ferrite Bead; Manufacturer: MURATA; Power: 2A; Resistance: 0.055R; Tolerance: ±25%; Part Number: IND0402_MURATA_BLM15PX121SN1D; Component Kind: Standard; Component Type: Standard; Pin Count: 2; Value: 120R@100MHz; Manufacturer Part Number: BLM15PX121SN1D; Case: 0402; Mounted: Yes; Socket: No; SMD: Yes; Sense: No; ComponentHeight: 0.55mm; HelpURL: \\cern.ch\dfs\Applications\Altium\Datasheets\IND0402_MURATA_BLM15PX.pdf; Author: CERN DEM JMW; CreateDate: 19.02.2014; LatestRevisionDate: 25.10.2018
L12-L15 = IND0603_MURATA_BLM18AG601SN1: Part Description: SMD EMIFIL Suppression Chip Ferrite Bead; Manufacturer: MURATA; Power: 500mA; Resistance: 0.38R; Tolerance: ±25%; Part Number: IND0603_MURATA_BLM18AG601SN1; Component Kind: Standard; Component Type: Standard; Pin Count: 2; Value: 600R@100MHz; Manufacturer Part Number: BLM18AG601SN1; Case: 0603; Mounted: Yes; Socket: No; SMD: Yes; Sense: No; ComponentHeight: 0.95mm; HelpURL: \\cern.ch\dfs\Applications\Altium\Datasheets\IND0603_MURATA_BLM18A.pdf; Author: CERN DEM MR; CreateDate: 01.04.2016; LatestRevisionDate: 25.10.2018; Status: None
R15 = R0402_100R_1%_0.0625W_100PPM: Resistor - 1%; Part Description: General Purpose Thick Film Chip Resistor; Manufacturer: GENERIC; Manufacturer1 Part Number: 232270671001L; TC: ±100ppm/°C; PressFit: No; Part Number: R0402_100R_1%_0.0625W_100PPM; Component Kind: Standard; Component Type: Standard; Pin Count: 2; Value: 100; Status: Not Recommended; Power: 0.0625W; Tolerance: ±1%; Manufacturer Part Number: R0402_100R_1%_0.0625W_100PPM; Case: 0402; Mounted: Yes; Sense: No; Socket: No; SMD: Yes; Manufacturer1 Example: YAGEO PHYCOMP; Manufacturer1 ComponentHeight: 0.4mm; HelpURL: \\cern.ch\dfs\Applications\Altium\Datasheets\R0402_Phycomp_RC0402.pdf; Author: CERN DEM JLC; CreateDate: 03.12.2007; LatestRevisionDate: 17.10.2012
R17 = R0402_120R_1%_0.0625W_100PPM: Resistor - 1%; Part Description: General Purpose Thick Film Chip Resistor; Manufacturer: GENERIC; Manufacturer1 Part Number: 232270671201L; TC: ±100ppm/°C; PressFit: No; Part Number: R0402_120R_1%_0.0625W_100PPM; Component Kind: Standard; Component Type: Standard; Pin Count: 2; Value: 120; Status: Not Recommended; Power: 0.0625W; Tolerance: ±1%; Manufacturer Part Number: R0402_120R_1%_0.0625W_100PPM; Case: 0402; Mounted: Yes; Sense: No; Socket: No; SMD: Yes; Manufacturer1 Example: YAGEO PHYCOMP; Manufacturer1 ComponentHeight: 0.4mm; HelpURL: \\cern.ch\dfs\Applications\Altium\Datasheets\R0402_Phycomp_RC0402.pdf; Author: CERN DEM JLC; CreateDate: 03.12.2007; LatestRevisionDate: 17.10.2012
R18 R45 = R0402_357R_0.1%_0.063W_50PPM: Resistor - 0.1%; Part Number: R0402_357R_0.1%_0.063W_25PPM; Part Description: Thin Film Chip Resistor; Manufacturer: GENERIC; Manufacturer1 Part Number: 1879214-5; TC: ±50ppm; PressFit: No; Component Kind: Standard; Component Type: Standard; Pin Count: 2; Value: 357; Status: Not Recommended; Manufacturer Part Number: R0402_357R_0.1%_0.063W_50PPM; Case: 0402; Mounted: Yes; Sense: No; Socket: No; SMD: Yes; Manufacturer1 Example: TE Connectivity / Amp; Author: SHA
R19 R38 = R0402_348R_0.1%_0.063W_25PPM: Resistor - 0.1%; Part Description: Thin Film Chip Resistor; Manufacturer: GENERIC; Manufacturer1 Part Number: RT0402BRD07348RL; TC: ±25ppm; PressFit: No; Part Number: R0402_348R_0.1%_0.063W_25PPM; Component Kind: Standard; Component Type: Standard; Pin Count: 2; Value: 348; Status: Not Recommended; Manufacturer Part Number: R0402_348R_0.1%_0.063W_25PPM; Case: 0402; Mounted: Yes; Sense: No; Socket: No; SMD: Yes; Manufacturer1 Example: YAGEO; Author: SHA
R34 R36 R37 R39 R40 R42 R51 R52 R54#1 R54#2 R56 R58 R59 R62 R63 R65-R68 R71 R85 = R0402_0R_JUMPER: Resistor; Part Description: 1A (0.05R Max DC Resistance) Zero Ohm Jumper; Manufacturer: GENERIC; Manufacturer1 Part Number: 232270591001L; PressFit: No; Part Number: R0402_0R_JUMPER; Component Kind: Standard; Component Type: Standard; Pin Count: 2; Value: 0; Status: Not Recommended; Manufacturer Part Number: R0402_0R_JUMPER; Case: 0402; Mounted: Yes; Sense: No; Socket: No; SMD: Yes; Manufacturer1 Example: YAGEO PHYCOMP; Manufacturer1 ComponentHeight: 0.4mm; HelpURL: \\cern.ch\dfs\Applications\Altium\Datasheets\R0402_Phycomp_RC0402.pdf; Author: CERN DEM JLC; CreateDate: 03.12.2007; LatestRevisionDate: 17.10.2012
R46 R48 R53 = R0402_49R9_1%_0.0625W_100PPM: Resistor - 1%; Part Description: General Purpose Thick Film Chip Resistor; Manufacturer: GENERIC; Manufacturer1 Part Number: 232270674999L or RC0402FR-0749R9L; TC: ±100ppm/°C; PressFit: No; Part Number: R0402_49R9_1%_0.0625W_100PPM; Component Kind: Standard; Component Type: Standard; Pin Count: 2; Value: 49R9; Status: Not Recommended; Power: 0.0625W; Tolerance: ±1%; Manufacturer Part Number: R0402_49R9_1%_0.0625W_100PPM; Case: 0402; Mounted: Yes; Sense: No; Socket: No; SMD: Yes; Manufacturer1 Example: YAGEO PHYCOMP; Manufacturer1 ComponentHeight: 0.4mm; HelpURL: \\cern.ch\dfs\Applications\Altium\Datasheets\R0402_Phycomp_RC0402.pdf; Author: CERN DEM JLC; CreateDate: 24.10.2012; LatestRevisionDate: 24.10.2012
R47 = R0603_49R9_0.1%_0.063W_10PPM: Resistor - 0.1%; Part Description: Thin Film Chip Resistor; Manufacturer: GENERIC; Manufacturer1 Part Number: RN73C1J49R9BTDF; Power: 0.063W; TC: ±10ppm; PressFit: No; Part Number: R0603_49R9_0.1%_0.063W_10PPM; Component Kind: Standard; Component Type: Standard; Pin Count: 2; Value: 49R9; Status: Not Recommended; Manufacturer Part Number: R0603_49R9_0.1%_0.063W_10PPM; Case: 0603; Mounted: Yes; Sense: No; Socket: No; SMD: Yes; Manufacturer1 Example: TYCO HOLSWORTHY; Manufacturer1 ComponentHeight: 0.5mm; HelpURL: \\cern.ch\dfs\Applications\Altium\Datasheets\R0603_Tyco_RN73.pdf; Author: CERN DEM JLC; CreateDate: 03.12.2007; LatestRevisionDate: 13.03.2008
R49 = R0603_140R_0.1%_0.063W_10PPM: Resistor - 0.1%; Part Description: Thin Film Chip Resistor; Manufacturer: GENERIC; Manufacturer1 Part Number: RN73C1J140RBTDF; Power: 0.063W; TC: ±10ppm; PressFit: No; Part Number: R0603_140R_0.1%_0.063W_10PPM; Component Kind: Standard; Component Type: Standard; Pin Count: 2; Value: 140; Status: Not Recommended; Manufacturer Part Number: R0603_140R_0.1%_0.063W_10PPM; Case: 0603; Mounted: Yes; Sense: No; Socket: No; SMD: Yes; Manufacturer1 Example: TYCO HOLSWORTHY; Manufacturer1 ComponentHeight: 0.5mm; HelpURL: \\cern.ch\dfs\Applications\Altium\Datasheets\R0603_Tyco_RN73.pdf; Author: CERN DEM JLC; CreateDate: 03.12.2007; LatestRevisionDate: 13.03.2008
R50 = R0603_34R8_0.1%_0.063W_10PPM: Resistor - 0.1%; Part Description: Thin Film Chip Resistor; Manufacturer: GENERIC; Manufacturer1 Part Number: RN73C1J34R8BTDF; Power: 0.063W; TC: ±10ppm; PressFit: No; Part Number: R0603_34R8_0.1%_0.063W_10PPM; Component Kind: Standard; Component Type: Standard; Pin Count: 2; Value: 34R8; Status: Not Recommended; Manufacturer Part Number: R0603_34R8_0.1%_0.063W_10PPM; Case: 0603; Mounted: Yes; Sense: No; Socket: No; SMD: Yes; Manufacturer1 Example: TYCO HOLSWORTHY; Manufacturer1 ComponentHeight: 0.5mm; HelpURL: \\cern.ch\dfs\Applications\Altium\Datasheets\R0603_Tyco_RN73.pdf; Author: CERN DEM JLC; CreateDate: 03.12.2007; LatestRevisionDate: 13.03.2008
R55 R57 = R0402_24R_1%_0.0625W_100PPM: Resistor - 1%; Part Description: General Purpose Thick Film Chip Resistor; Manufacturer: GENERIC; Manufacturer1 Part Number: 232270672409L; TC: ±100ppm/°C; PressFit: No; Part Number: R0402_24R_1%_0.0625W_100PPM; Component Kind: Standard; Component Type: Standard; Pin Count: 2; Value: 24; Status: Not Recommended; Power: 0.0625W; Manufacturer Part Number: R0402_24R_1%_0.0625W_100PPM; Case: 0402; Mounted: Yes; Sense: No; Socket: No; SMD: Yes; Manufacturer1 Example: YAGEO PHYCOMP; Manufacturer1 ComponentHeight: 0.4mm; HelpURL: \\cern.ch\dfs\Applications\Altium\Datasheets\R0402_Phycomp_RC0402.pdf; Author: CERN DEM JLC; CreateDate: 03.12.2007; LatestRevisionDate: 17.10.2012
R72 R73 = R0402_10K_1%_0.0625W_100PPM: Resistor - 1%; Part Description: General Purpose Thick Film Chip Resistor; Manufacturer: GENERIC; Manufacturer1 Part Number: 232270671003L; TC: ±100ppm/°C; PressFit: No; Part Number: R0402_10K_1%_0.0625W_100PPM; Component Kind: Standard; Component Type: Standard; Pin Count: 2; Value: 10k; Status: Not Recommended; Power: 0.0625W; Tolerance: ±1%; Manufacturer Part Number: R0402_10K_1%_0.0625W_100PPM; Case: 0402; Mounted: Yes; Sense: No; Socket: No; SMD: Yes; Manufacturer1 Example: YAGEO PHYCOMP; Manufacturer1 ComponentHeight: 0.4mm; HelpURL: \\cern.ch\dfs\Applications\Altium\Datasheets\R0402_Phycomp_RC0402.pdf; Author: CERN DEM JLC; CreateDate: 03.12.2007; LatestRevisionDate: 17.10.2012
SW2 SW3 = SW_OMRON_A6SN-1101: 1 Ways SPST DIP Switch; Part Description: 1 Way SPST Surface-Mounting Slide Switch With Flat Actuator, Contact Rating 25mA 24VDC; Manufacturer: OMRON; PressFit: No; Part Number: SW_OMRON_A6SN-1101; Component Kind: Standard; Component Type: Standard; Pin Count: 2; PackageDescription: Body 4.48x7.5mm, 1 Way SPST Surface-Mounting Slide Switch With Flat Actuator (A6SN Series); Family: Switch; Mounted: Yes; Socket: No; SMD: Yes; Sense: No; Status: None; Manufacturer Part Number: A6SN-1101; ComponentHeight: 4.6mm; HelpURL: \\cern.ch\dfs\Applications\Altium\Datasheets\SW_OMRON_A6SN-1101.pdf; Author: CERN DEM JLC; CreateDate: 25.02.2013; LatestRevisionDate: 25.02.2013
TP7 TP10 TP11 = SMD_PAD_1.27X1.27MM: Part Description: 1.27mm x 1.27mm PCB Copper Area (SMD Test Point); Mounted: No; Part Number: SMD_PAD_1.27X1.27MM; Component Type: Standard (No BOM); Pin Count: 1; Family: Test Point; Socket: No; SMD: No; Sense: No; Status: None; ComponentHeight: 0mm; HelpURL: Undefined; Author: CERN DEM JLC; CreateDate: 12.01.2008; LatestRevisionDate: 12.01.2008; PackageDescription: 1.27mm x 1.27mm PCB Copper Area (SMD Test Point)
TR3 = XFMR_MINI-CIRCUITS_TC1-1-13M+: 50 Ohms 4.5 To 3000MHz RF Transformers; Part Number: XFMR_MINI-CIRCUITS_TC1-1-13M+; Component Kind: Standard; Component Type: Standard; Pin Count: 5; Value: 1:1; Status: None; Part Description: 50 Ohms 4.5 to 3000MHz RF Transformer; Manufacturer: MINI-CIRCUITS; Manufacturer Part Number: TC1-1-13M+; Mounted: Yes; Socket: No; Sense: No; SMD: Yes; ComponentHeight: 3.81mm; HelpURL: \\cern.ch\dfs\Applications\Altium\Datasheets\XFMR_MINI-CIRCUITS_TC1-1-13M+.pdf; Author: CERN DEM JLC; CreateDate: 30.11.2011; LatestRevisionDate: 30.11.2011